# EAGLE design MySensors_AirQuality_Board_2017-11-27_esp8266 (EAGLE 8.3.2)
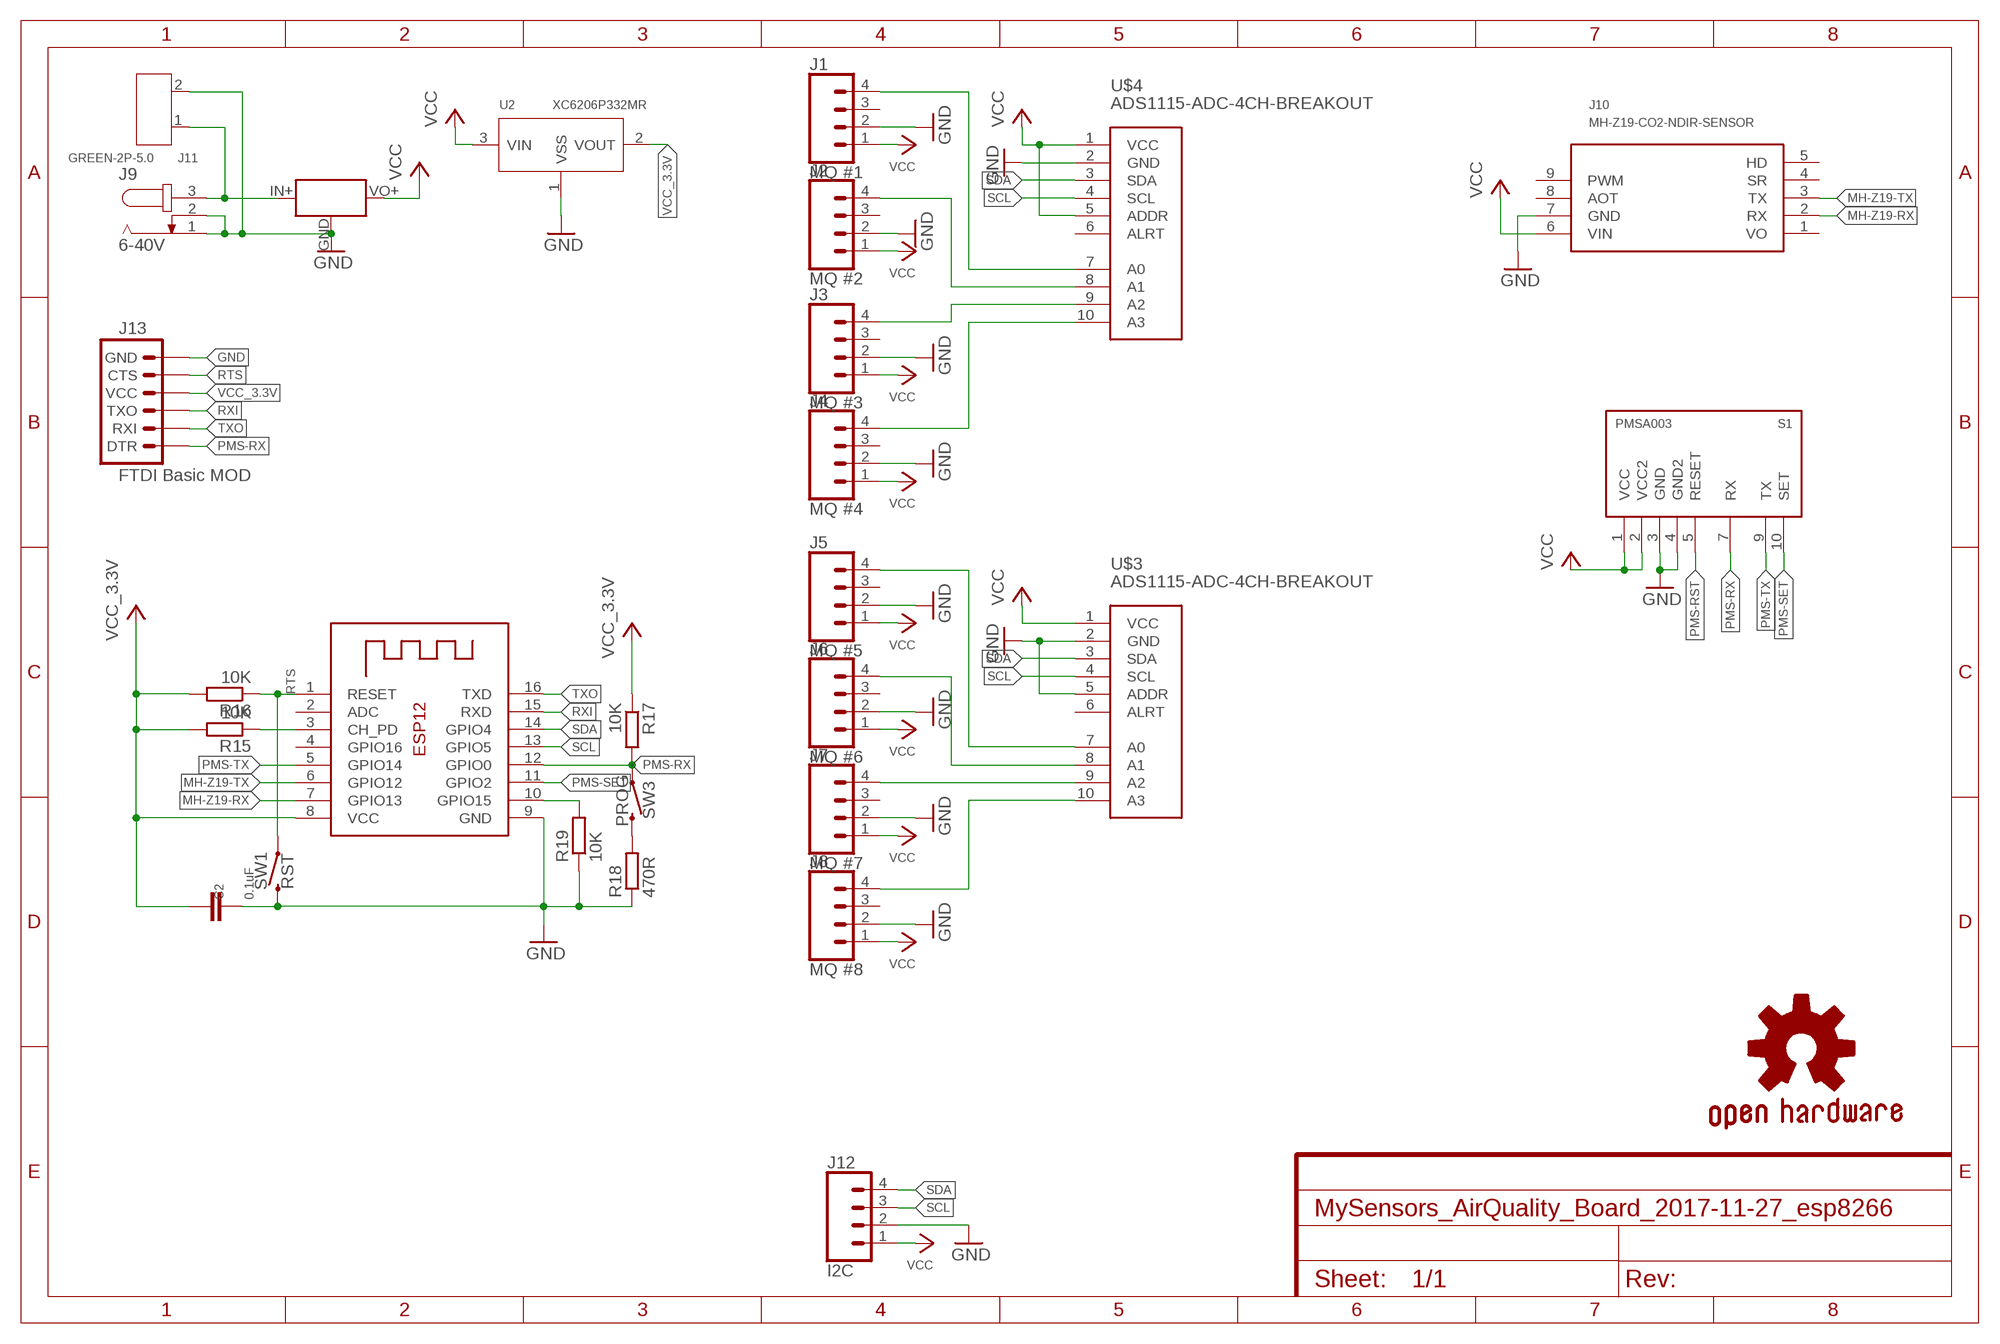
[diagram p0: schematic, sheet 1]
FRAME1 (FRAME-A4L): CNAME: MySensors AirQuality Board; CREVISION: 0.01; DESIGNER: R. Kainhofer, 2017-11-03

## Parts
C2  0.1uF  C-EUC0805  [C0805]
GOLD_ORB_SM1  OSHWLOGO_GOLD_ORB_SM  [OSHW2]
J1  MQ #1  CONN_04  [1X04]
J2  MQ #2  CONN_04  [1X04]
J3  MQ #3  CONN_04  [1X04]
J4  MQ #4  CONN_04  [1X04]
J5  MQ #5  CONN_04  [1X04]
J6  MQ #6  CONN_04  [1X04]
J7  MQ #7  CONN_04  [1X04]
J8  MQ #8  CONN_04  [1X04]
J9  6-40V  JACK-PLUG1  [SPC4078]
J10  MH-Z19-CO2-NDIR-SENSOR  [MH-Z19]
J11  GREEN-2P-5.0  SCREW-TERMINAL-GREEN(2P-5.0)  [H2-5.0-10.5X8.0MM]
J12  I2C  CONN_04  [1X04]
J13  FTDI Basic MOD  ARDUINO_SERIAL_PROGRAMPTH  [1X06]
R15  10K  R-EU_R0805  [R0805]
R16  10K  R-EU_R0805  [R0805]
R17  10K  R-EU_R0805  [R0805]
R18  470R  R-EU_R0805  [R0805]
R19  10K  R-EU_R0805  [R0805]
S1  PMSA003  [PMSA003]
SW1  RST  MOMENTARY-SWITCH-SPST-SMD-6.0X3.5MM  [TACTILE_SWITCH_SMD_6.0X3.5MM]
SW3  PROG  MOMENTARY-SWITCH-SPST-SMD-6.0X3.5MM  [TACTILE_SWITCH_SMD_6.0X3.5MM]
U2  XC6206P332MR  PMIC-LDO-XC6206P332MR-G(SOT23)  [SOT-23]
U$2  MINI_BUCK_CONVERTER  [MINI_BUCK_CONVERTER]
U$3  ADS1115-ADC-4CH-BREAKOUT  [ADS1115-ADC-4CH-BREAKOUT]
U$4  ADS1115-ADC-4CH-BREAKOUT  [ADS1115-ADC-4CH-BREAKOUT]
X2  ESP-12e  ESP-12  [ESP-12]

## Nets
A0: J1.4 U$4.7(A0)
A1: J2.4 U$4.8(A1)
A2: J3.4 U$4.9(A2)
A3: J4.4 U$4.10(A3)
CH_PD: R15.1 X2.3(CH_PD)
GND: C2.1 J1.2 J2.2 J3.2 J4.2 J5.2 J6.2 J7.2 J8.2 J9.1 J9.2 J10.7(GND) J11.2 J12.2 J13.6(GND) R18.1 R19.1 S1.3(GND) S1.4(GND2) SW1.2 U2.1(VSS) U$2.GND U$3.2(GND) U$3.5(ADDR) U$4.2(GND) X2.9(GND)
GPIO15: R19.2 X2.10(GPIO15)
MH-Z19-RX: J10.2(RX) X2.7(GPIO13)
MH-Z19-TX: J10.3(TX) X2.6(GPIO12)
N$1: J5.4 U$3.7(A0)
N$2: J9.3 J11.1 U$2.IN+(VIN)
N$3: J6.4 U$3.8(A1)
N$4: J7.4 U$3.9(A2)
N$5: J8.4 U$3.10(A3)
N$6: R18.2 SW3.2
PMS-RST: S1.5(RESET)
PMS-RX: J13.1(DTR) R17.2 S1.7(RX) SW3.1 X2.12(GPIO0)
PMS-SET: S1.10(SET) X2.11(GPIO2)
PMS-TX: S1.9(TX) X2.5(GPIO14)
RTS: J13.5(CTS) R16.1 SW1.1 X2.1(RESET)
RXI: J13.3(TXO) X2.15(RXD)
SCL: J12.3 U$3.4(SCL) U$4.4(SCL) X2.13(GPIO5)
SDA: J12.4 U$3.3(SDA) U$4.3(SDA) X2.14(GPIO4)
TXO: J13.2(RXI) X2.16(TXD)
VCC: J1.1 J2.1 J3.1 J4.1 J5.1 J6.1 J7.1 J8.1 J10.6(VIN) J12.1 S1.1(VCC) S1.2(VCC2) U2.3(VIN) U$2.VO+(VOUT) U$3.1(VCC) U$4.1(VCC) U$4.5(ADDR)
VCC_3.3V: C2.2 J13.4(VCC) R15.2 R16.2 R17.1 U2.2(VOUT) X2.8(VCC)
Unconnected: J1.3 J2.3 J3.3 J4.3 J5.3 J6.3 J7.3 J8.3 J10.4(SR) J10.5(HD) J10.8(AOT) J10.9(PWM) U$3.6(ALRT) U$4.6(ALRT) X2.2(ADC) X2.4(GPIO16)

## Power pins joined to a net without a drawn wire
VO: J10.1(VO)

## Library data of the parts
C2 = resistor:C-EU: CAPACITOR, European symbol
GOLD_ORB_SM1 = bfl:OSHWLOGO: These are Open-Source Hardware logos.
J1-J8 J12 = SparkFun-Connectors:CONN_04: Multi connection point. Often used as Generic Header-pin footprint for 0.1 inch spaced/style header connections On any of the 0.1 inch spaced packages, you can populate with these: Break Away Headers - Straight <https://www.sparkfun.com/products/116> (PRT-00116) Break Away Male Headers - Right Angle <https://www.sparkfun.com/products/553> (PRT-00553) Female Headers <https://www.sparkfun.com/products/115> (PRT-00115) Break Away Headers - Machine Pin <https://www.sparkfun.com/products/117> (PRT-00117) Break Away Female Headers - Swiss Machine Pin <https://www.sparkfun.com/products/743> (PRT-00743) For SCREWTERMINALS and SPRING TERMINALS visit here: Screw Terimnals on SparkFun.com <https://www.sparkfun.com/search/results?term=Screw+Terminals> (5mm/3.5mm/2.54mm spacing) This device is also useful as a general connection point to wire up your design to another part of your project. Our various solder wires solder well into these plated through hole pads. Hook-Up Wire - Assortment (Stranded, 22 AWG) <https://www.sparkfun.com/products/11375> (PRT-11375) Hook-Up Wire - Assortment (Solid Core, 22 AWG) <https://www.sparkfun.com/products/11367> (PRT-11367) View the entire wire category on our website here <https://www.sparkfun.com/categories/141> Special notes: Molex polarized connector foot print use with SKU : PRT-08231 with associated crimp pins and housings. 1MM SMD Version SKU: PRT-10208; PROD_ID: CONN-09696
J9 = con-jack:JACK-PLUG: DC POWER JACK Power Jack, DC, Right Angle, Through Hole, Rated 5A at 16VDC, PC Terminals Distributor: Farnell (www.Farnell.de) Drawing: 84N1161.pdf / 84N1162.pdf Manufacturer: SPC Technology (www.spctechnology.com) Type: SPC4077 / SPC 4078; OC_FARNELL: unknown; OC_NEWARK: unknown
J10 = mh-z19:MH-Z19: MH-Z19 - CO2 NDIR SENSOR
J11 = Seeed-Connector:SCREW-TERMINAL-GREEN(2P-5.0): 320110031
J13 = SparkFun:ARDUINO_SERIAL_PROGRAM
R15-R19 = rcl:R-EU_: RESISTOR, European symbol
S1 = opentools-sensors:PMS: PLANTOWER PMSx003 Laser PM2.5 Dust Sensor
SW1 SW3 = SparkFun-Switches:MOMENTARY-SWITCH-SPST: Momentary Switch (Pushbutton) - SPST Normally-open (NO) SPST momentary switches (buttons, pushbuttons). Variants PTH-12MM - 12mm square, through-hole Momentary Pushbutton Switch - 12mm Square <https://www.sparkfun.com/products/9190> (COM-09190) PTH-6.0MM, PTH-6.0MM-KIT - 6.0mm square, through-hole Mini Pushbutton Switch <https://www.sparkfun.com/products/97> (COM-00097) KIT package intended for soldering kit's - only one side of pads' copper is exposed. PTH-RIGHT-ANGLE-KIT - Right-angle, through-hole Right Angle Tactile Button <https://www.sparkfun.com/products/10791> - Used on SparkFun BigTime Watch Kit <https://www.sparkfun.com/products/11734> SMD-12MM - 12mm square, surface-mount Tactile Button - SMD (12mm) <https://www.sparkfun.com/products/12993> (COM-12993) Used on SparkFun PicoBoard <https://www.sparkfun.com/products/11888> SMD-4.5MM - 4.5mm Square Trackball Switch Used on SparkFun Blackberry Trackballer Breakout <https://www.sparkfun.com/products/13169> SMD-4.6MMX2.8MM - 4.60mm x 2.80mm, surface mount Used on SparkFun SAMD21 Mini Breakout <https://www.sparkfun.com/products/13664> SMD-5.2MM, SMD-5.2-REDUNDANT - 5.2mm square, surface-mount Mini Pushbutton Switch - SMD <https://www.sparkfun.com/products/8720> (COM-08720) Used on Arduino Pro Mini <https://www.sparkfun.com/products/11114> REDUNDANT package connects both switch circuits together SMD-6.0X3.5MM - 6.0 x 3.5mm, surface mount Momentary Reset Switch SMD <https://www.sparkfun.com/products/8229> (COM-08229) SMD-6.2MM-TALL - 6.2mm square, surface mount Tactile Button - SMD (6mm) <https://www.sparkfun.com/products/12992> Used on SparkFun Digital Sandbox <https://www.sparkfun.com/products/12651> SMD-RIGHT-ANGLE - Right-angle, surface mount Used on SparkFun Block for Intel® Edison - Arduino <https://www.sparkfun.com/products/13036>; PROD_ID: SWCH-00815; SF_SKU: COM-08229
U2 = Seeed-IC:PMIC-LDO-XC6206P332MR-G(SOT23): 310030099; MPN: XC6206P332MR-G; VALUE: XC6206P332MR-G-SOT23
U$2 = opentools-sensors:MINI_BUCK_CONVERTER: 4.5-40V Step Down Buck Converter
U$3 U$4 = opentools-sensors:ADS1115-ADC-4CH-BREAKOUT: 4 Channel 16-Bit Analog-to-Digital Converter based on ADS1115 chip Arduino ADS1115 Getting Started Tutorial is available here: http://henrysbench.capnfatz.com/henrys-bench/arduino-voltage-measurements/arduino-ads1115-module-getting-started-tutorial/ ADS1115 datasheet is available here: http://www.ti.com/lit/ds/symlink/ads1115.pdf Click here to find device on ebay.com <http://www.ebay.com/sch/ads1115+module>
X2 = adafruit:ESP-12

## Net classes
0 default: width 0.203 mm

## Board
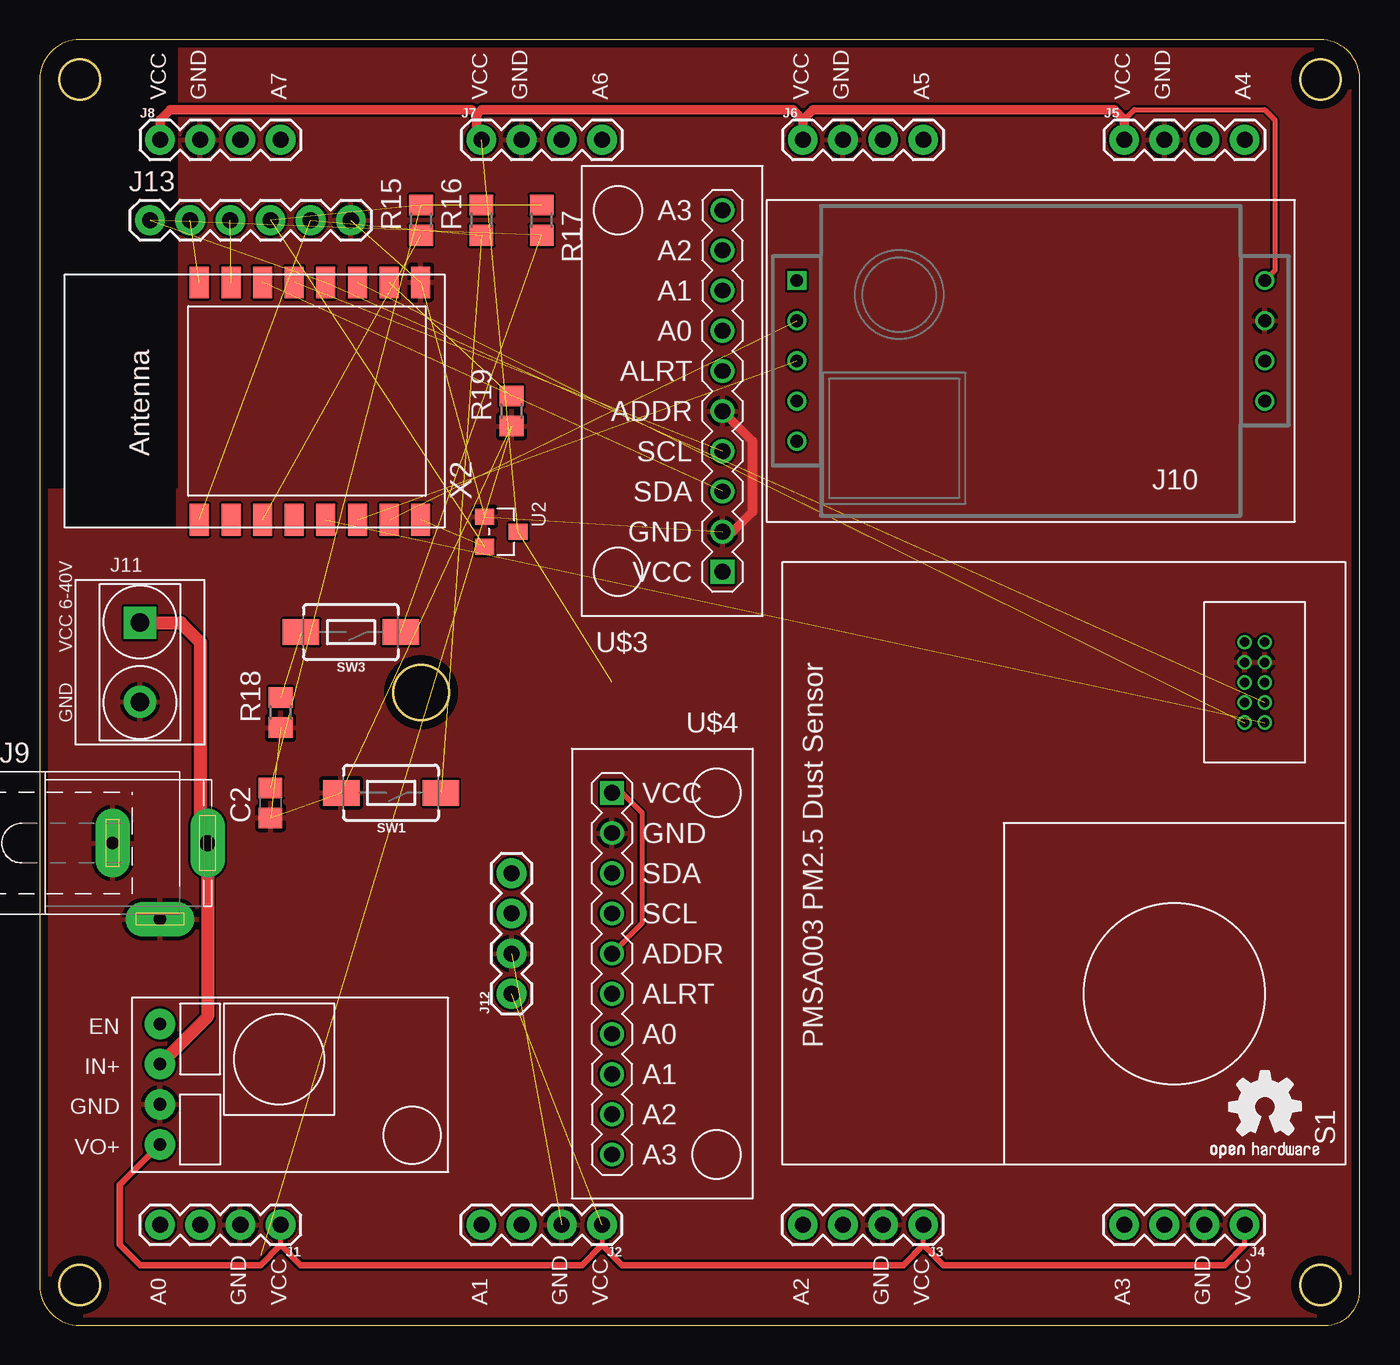
[diagram p1: board, top side]
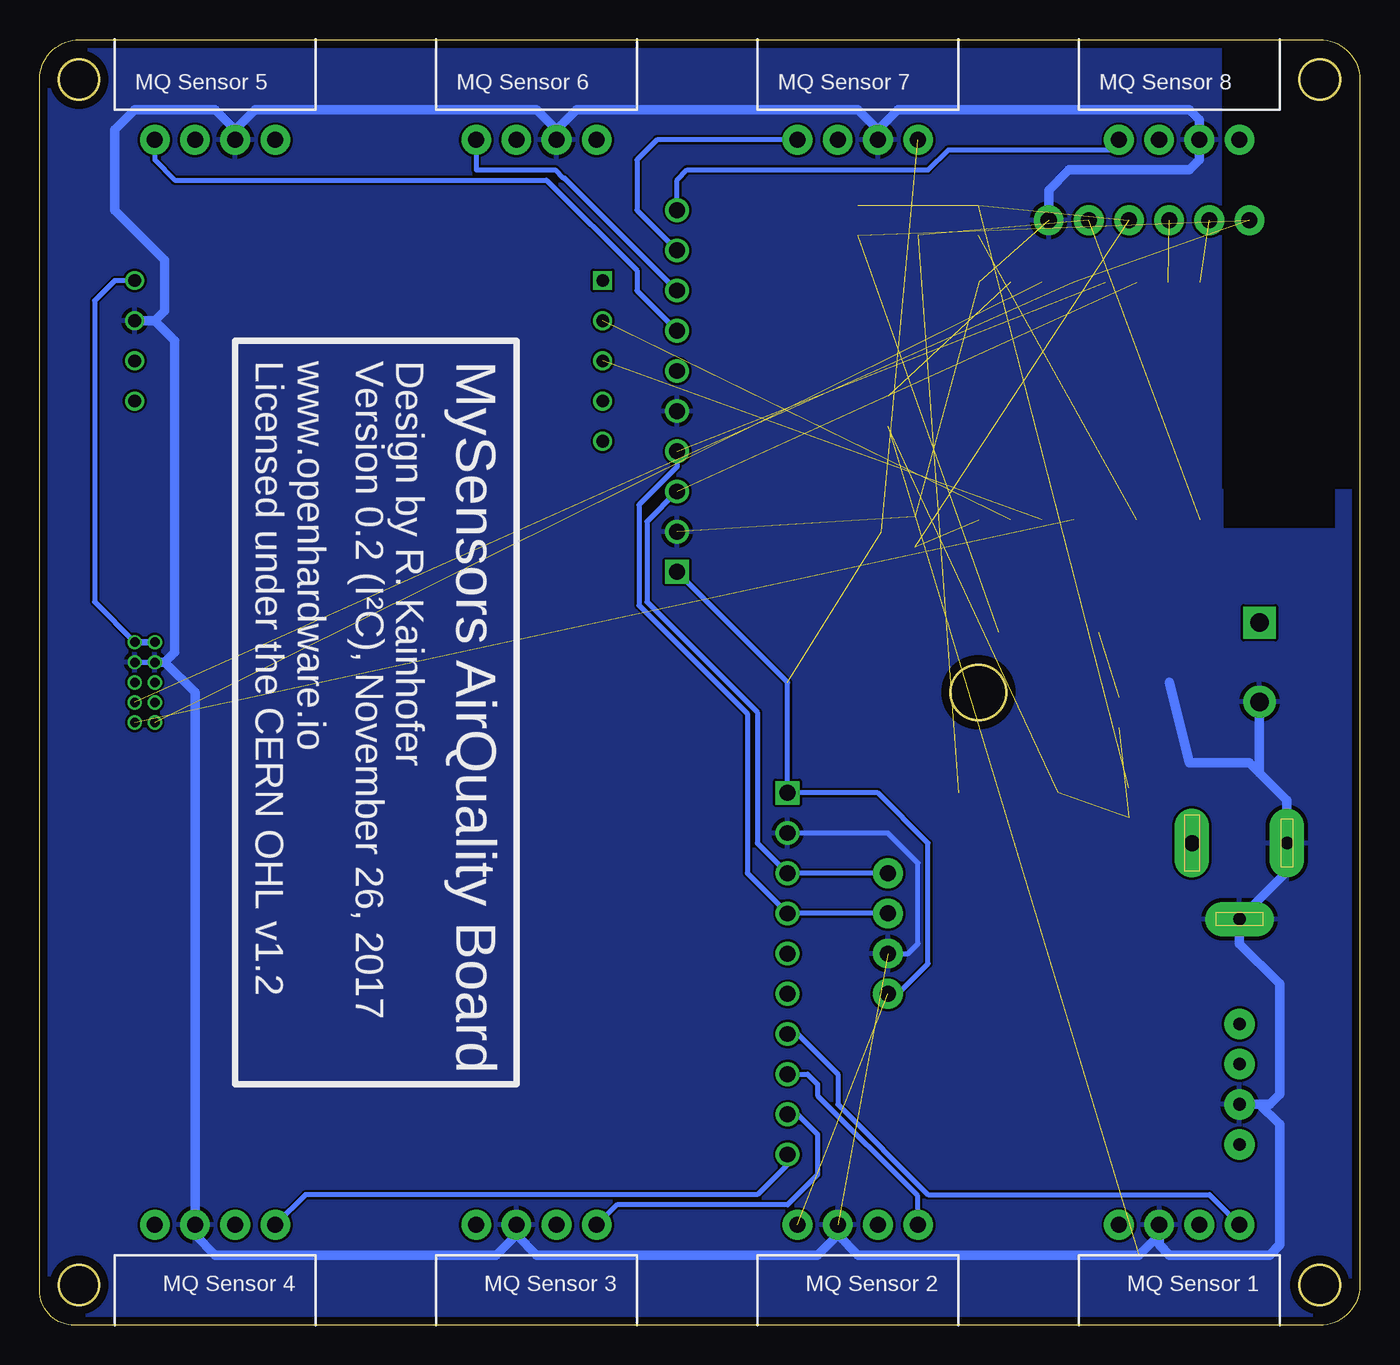
[diagram p2: board, bottom side, seen from below]

Size 83.49 x 81.27 mm. Coordinates in mm from the lower left corner, seen from the top.
Outline: 0,78.73 0,2.54 arc90 2.54,0 81.28,0 arc90 83.49,2.21 83.49,78.74 arc90 80.96,81.27 2.54,81.27 arc90 0,78.73
Outline: circle at 2.54,78.74 radius 1.27
Outline: circle at 2.54,2.54 radius 1.27
Outline: circle at 81,2.54 radius 1.27
Outline: circle at 81,78.74 radius 1.27
Outline: circle at 24.13,40.01 radius 1.75
Copper layers (1*16): Top 0.035mm / dielectric 1.6mm / Bottom 0.035mm
Design rules "Elecrow_2-layer_PCB_eagle_rule": minimum track width 6mil, minimum drill 12mil, track to track 6mil, track to pad 6mil, pad to pad 6mil, via to via 8mil, smd to smd 0mil, copper to edge 20mil, drill to drill 10mil, minimum pad ring 6mil, minimum via ring 6mil, stop-mask expansion 0mil, vias tented up to drill 100mil, thermal gap 10mil

### Footprints (pad centres in the part's own frame; a part is rotated, then mirrored left to right if it is on the bottom)
C0805 = smd 1.3 x 1.5: 1 -0.95,0; 2 0.95,0
1X04 = drill 1.016 pad 1.88: 1 0,0; 2 2.54,0; 3 5.08,0; 4 7.62,0
SPC4078 = drill 0.8 pad 2.184 long: 1 -3,0; 2 0,-4.8 | drill 1 pad 2.184 long: 3 3,0
MH-Z19 = drill 0.8 square: 1 29.591,0 | drill 0.8: 2 29.591,2.54; 3 29.591,5.08; 4 29.591,7.62; 5 29.591,10.16; 6 0,0; 7 0,2.54; 8 0,5.08; 9 0,7.62
H2-5.0-10.5X8.0MM = drill 1.168 pad 2.032 square: 1 0,2.5 | drill 1.168 pad 2.032: 2 0,-2.5
1X06 = drill 1.016 pad 1.88: 1 0,0; 2 2.54,0; 3 5.08,0; 4 7.62,0; 5 10.16,0; 6 12.7,0
R0805 = smd 1.3 x 1.5: 1 -0.95,0; 2 0.95,0
PMSA003 = drill 0.6: 1 5.08,-5.08; 2 5.08,-6.35; 3 6.35,-5.08; 4 6.35,-6.35; 5 7.62,-5.08; 6 7.62,-6.35; 7 8.89,-5.08; 8 8.89,-6.35; 9 10.16,-5.08; 10 10.16,-6.35
TACTILE_SWITCH_SMD_6.0X3.5MM = smd 2.3 x 1.6: 1 -3.15,0; 2 3.15,0
SOT-23 = smd 1.016 x 1.2: 1 -0.95,-1.06; 2 0.95,-1.06; 3 0,1.06
MINI_BUCK_CONVERTER = drill 0.8 pad 1.93: EN 1.27,1.27; GND 6.35,1.27; IN+ 3.81,1.27; VO+ 8.89,1.27
ADS1115-ADC-4CH-BREAKOUT = drill 1 square: 1 -6.35,11.43 | drill 1: 2 -6.35,8.89; 3 -6.35,6.35; 4 -6.35,3.81; 5 -6.35,1.27; 6 -6.35,-1.27; 7 -6.35,-3.81; 8 -6.35,-6.35; 9 -6.35,-8.89; 10 -6.35,-11.43
ESP-12 = smd 2 x 1.2: 1 -7.5,4.5; 2 -7.5,2.5; 3 -7.5,0.5; 4 -7.5,-1.5; 5 -7.5,-3.5; 6 -7.5,-5.5; 7 -7.5,-7.5; 8 -7.5,-9.5; 9 7.5,-9.5; 10 7.5,-7.5; 11 7.5,-5.5; 12 7.5,-3.5; 13 7.5,-1.5; 14 7.5,0.5; 15 7.5,2.5; 16 7.5,4.5

### Placement (x,y rotation side)
C2  14.61,33.02 90 top
GOLD_ORB_SM1  73.66,9.53 0 top
J1  15.24,6.35 180 top
J2  35.56,6.35 180 top
J3  55.88,6.35 180 top
J4  76.2,6.35 180 top
J5  68.58,74.93 0 top
J6  48.26,74.93 0 top
J7  27.94,74.93 0 top
J8  7.62,74.93 0 top
J9  7.62,30.48 0 top
J10  77.47,66.04 180 top
J11  6.35,41.91 0 top
J12  29.84,20.95 90 top
J13  6.99,69.85 0 top
R15  24.13,69.85 90 top
R16  27.94,69.85 90 top
R17  31.75,69.85 270 top
R18  15.24,38.74 90 top
R19  29.84,57.79 90 top
S1  82.55,48.26 270 top
SW1  22.23,33.66 180 top
SW3  19.68,43.82 180 top
U2  29.21,50.17 270 top
U$2  6.35,20.32 270 top
U$3  36.83,59.05 180 top
U$4  42.55,22.22 0 top
X2  14.61,58.42 90 top

### Tracks (layer width: path | path; a pad name or v marks a point on that pad's centre or on a via)
A0
  Bottom 0.305: U$4.7 35.56,18.41 33.02,15.88 33.02,13.97 27.3,8.26 9.53,8.26 J1.4
A1  (via drill 0.35)
  Top 0.305: v27.98,6.39 J2.4
  Bottom 0.305: U$4.8 34.92,15.88 34.29,15.24 34.29,14.52 27.98,8.21 v27.98,6.39
A2
  Bottom 0.305: U$4.9 35.56,13.33 34.29,12.06 34.29,9.53 36.2,7.62 46.99,7.62 J3.4
A3
  Bottom 0.305: U$4.10 36.2,10.16 38.1,8.26 66.67,8.26 J4.4
CH_PD  (1 unrouted)
GND  (8 unrouted)
  Top 0.305: J6.2 50.8,74.3
  Top 0.61: U$3.5 45.09,55.88 45.09,51.44 43.81,50.17 U$3.2
  Bottom 0.305: S1.3 S1.4 | J12.2 28.57,23.5 27.94,24.13 27.94,29.21 29.84,31.11 U$4.2
  Bottom 0.406: 7.9,25.4 J9.2
  Bottom 0.61: 30.48,75.56 31.75,76.83 49.53,76.83 50.8,75.56 | J7.2 30.48,75.56 | 30.48,75.56 29.21,76.83 10.79,76.83 10.16,76.2 J8.2 10.16,73.66 10.79,73.02 18.41,73.02 19.68,71.75 J13.6 | J6.2 50.8,75.56 | 50.8,75.56 52.07,76.83 69.85,76.83 71.12,75.56 | 76.2,63.5 J10.7 | 6.35,34.93 J11.2 | 6.35,34.93 4.62,33.2 J9.1 4.62,28.68 J9.2 | 33.02,5.71 31.75,4.45 13.97,4.45 12.7,5.71 J1.2 12.7,5.08 12.06,4.45 5.71,4.45 5.08,5.08 5.08,12.7 6.35,13.97 | 33.02,5.71 J2.2 | 33.02,5.71 34.29,4.45 52.07,4.45 53.34,5.71 | J3.2 53.34,5.71 | 53.34,5.71 54.61,4.45 72.39,4.45 73.66,5.71 J4.2 73.66,40.01 75.56,41.91 | 6.35,13.97 U$2.GND | 6.35,13.97 5.71,13.97 5.08,14.61 5.08,21.59 7.62,24.13 7.62,25.12 7.9,25.4 | 12.06,40.64 10.79,35.56 6.99,35.56 6.35,34.93 | 75.56,41.91 74.93,42.55 74.93,62.23 76.2,63.5 | S1.4 75.56,41.91 | J5.2 71.12,75.56 | 71.12,75.56 72.39,76.83 77.47,76.83 78.74,75.56 78.74,70.48 75.56,67.31 75.56,64.14 76.2,63.5
  pour Bottom: 0,0 83.82,0 83.82,81.28 8.89,81.28 8.89,52.71 0,52.71
  pour Top: 0,0 83.82,0 83.82,81.28 8.89,81.28 8.89,52.71 0,52.71
GPIO15  (1 unrouted)
MH-Z19-RX  (1 unrouted)
MH-Z19-TX  (1 unrouted)
N$1
  Bottom 0.305: J5.4 76.2,73.66 74.93,72.39 51.44,72.39 45.72,66.67 45.72,65.41 U$3.7
N$2
  Top 0.813: J11.1 8.93,44.41 10.16,43.18 10.16,30.94 J9.3 10.62,19.51 U$2.IN+
N$3
  Bottom 0.305: J6.4 55.88,73.02 50.88,73.02 50.38,72.52 50.29,72.52 U$3.8
N$4
  Bottom 0.305: 35.56,74.52 J7.4 44.45,74.93 45.72,73.66 45.72,70.48 U$3.9
N$5
  Bottom 0.305: U$3.10 43.18,72.39 42.55,73.02 27.3,73.02 26.04,74.3 15.88,74.3 J8.4
N$6  (1 unrouted)
PMS-RX  (4 unrouted)
PMS-SET  (1 unrouted)
PMS-TX  (1 unrouted)
RTS  (3 unrouted)
RXI  (1 unrouted)
SCL  (1 unrouted)
  Bottom 0.305: U$3.4 43.18,54.27 45.59,51.86 45.59,45.51 38.73,38.65 38.73,28.57 36.51,26.35 | 36.51,26.35 U$4.4 | J12.3 U$4.4 | U$4.4 36.51,26.35
SDA  (1 unrouted)
  Bottom 0.305: U$3.3 45.09,50.8 45.09,45.72 38.1,38.74 38.1,30.48 U$4.3 J12.4
TXO  (1 unrouted)
VCC  (3 unrouted)
  Top 0.305: 15.24,5.08 J1.1 | J2.1 35.56,5.08 | 55.88,5.08 J3.1 | 76.2,5.08 J4.1 | 68.58,76.2 69.22,76.83 77.47,76.83 78.11,76.2 78.11,66.67 J10.6 | U$4.1 36.83,33.66 38.1,32.38 38.1,25.4 U$4.5
  Top 0.406: 76.2,5.08 74.93,3.81 57.15,3.81 55.88,5.08 54.61,3.81 36.83,3.81 35.56,5.08 34.29,3.81 16.51,3.81 15.24,5.08 13.97,3.81 6.35,3.81 5.08,5.08 5.08,8.89 U$2.VO+
  Top 0.61: 27.62,76.52 27.3,76.83 8.26,76.83 7.62,76.2 J8.1 | J7.1 27.62,75.25 27.62,76.52 | 27.62,76.52 27.94,76.83 47.62,76.83 48.26,76.2 | 48.26,76.2 J6.1 | 48.26,76.2 48.9,76.83 67.94,76.83 68.58,76.2 J5.1
  Bottom 0.305: J10.6 78.74,66.04 80.01,64.77 80.01,45.72 S1.1 | U$3.1 36.2,40.64 U$4.1 30.48,33.66 27.3,30.48 27.3,22.86 29.21,20.95 J12.1
  Bottom 0.406: S1.1 S1.2
VCC_3.3V  (6 unrouted)

### Text on the board
tPlace: VCC / GND / / A7 | VCC / GND / / A6 | VCC / GND / / A5 | VCC / GND / / A4 | VCC 6-40V | GND | EN / IN+ / GND / VO+ | A0 / / GND / VCC | A1 / / GND / VCC | A2 / / GND / VCC | A3 / / GND / VCC
bPlace: MQ Sensor 8 | MQ Sensor 7 | MQ Sensor 6 | MQ Sensor 5 | MySensors AirQuality Board | Design by R. Kainhofer | Version 0.2 (I²C), November 26, 2017 | www.openhardware.io / Licensed under the CERN OHL v1.2 | MQ Sensor 1 | MQ Sensor 2 | MQ Sensor 3 | MQ Sensor 4